# EAGLE design diode_winductor (EAGLE 6.5.0)
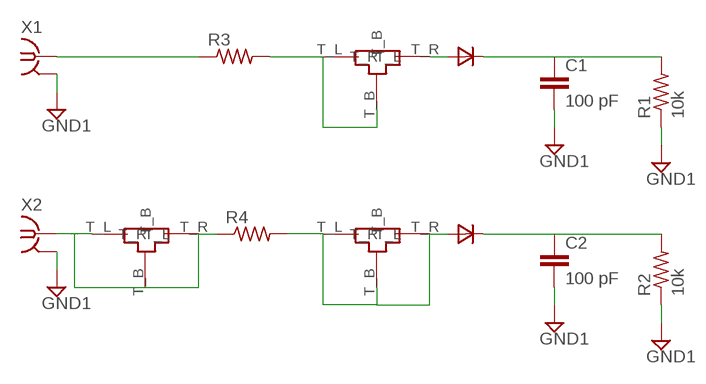
[diagram p0: schematic, sheet 1]

## Parts
C1  100 pF  C-EUC0603  [C0603]
C2  100 pF  C-EUC0603  [C0603]
INPUT  TEE_TL1  [TEE_TL1]
INPUT1  TEE_TL1  [TEE_TL1]
INPUT2  TEE_TL1  [TEE_TL1]
R1  10k  R-US_M1206  [M1206]
R2  10k  R-US_M1206  [M1206]
R3  R-US_R0603  [R0603]
R4  R-US_R0603  [R0603]
U$1  HSMS-2850  [HSMS-2850]
U$2  HSMS-2850  [HSMS-2850]
X1  SMA-142-0701-801/806  [J502-ND-142-0701-801/806]
X2  SMA-142-0701-801/806  [J502-ND-142-0701-801/806]

## Nets
GND1: C1.2 C2.2 R1.1 R2.1 X1.G@1 X1.G@2 X1.G@3 X1.G@4 X2.G@1 X2.G@2 X2.G@3 X2.G@4
INPUT: INPUT.T_B INPUT.T_L INPUT.T_R R3.2 U$1.A
INPUT1: INPUT2.T_B INPUT2.T_L INPUT2.T_R R4.1 X2.1
INPUT2: INPUT1.T_B INPUT1.T_L INPUT1.T_R R4.2 U$2.A
INPUT11: R3.1 X1.1
N$3: C1.1 R1.2 U$1.C
N$4: C2.1 R2.2 U$2.C

## Library data of the parts
C1 C2 = rcl:C-EU: CAPACITOR, European symbol
INPUT INPUT1 INPUT2 = ECE532_Parts:TEE_TL1
R1-R4 = rcl:R-US_: RESISTOR, American symbol
U$1 U$2 = ECE532_Parts:HSMS-2850
X1 X2 = con-coax:SMA-: SMA 50 Ohm End Launch Jack Receptacle - Round Contact Johnson Components Source: www.johnsoncomponents.com .. J502-ND.pdf; MF: JOHNSON COMPONENTS; MPN: 142-0701-801; OC_FARNELL: 1608592; OC_NEWARK: 90F2624

## Board
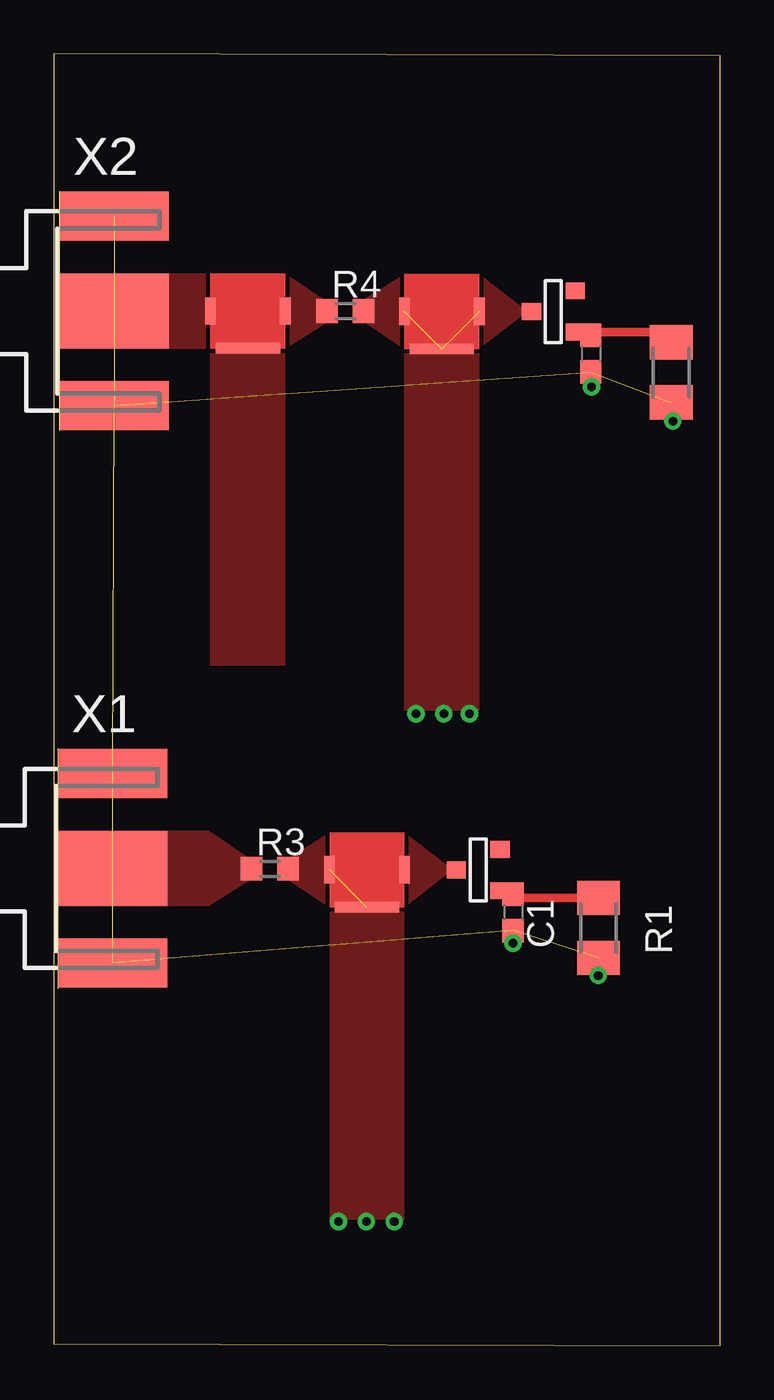
[diagram p1: board, top side]
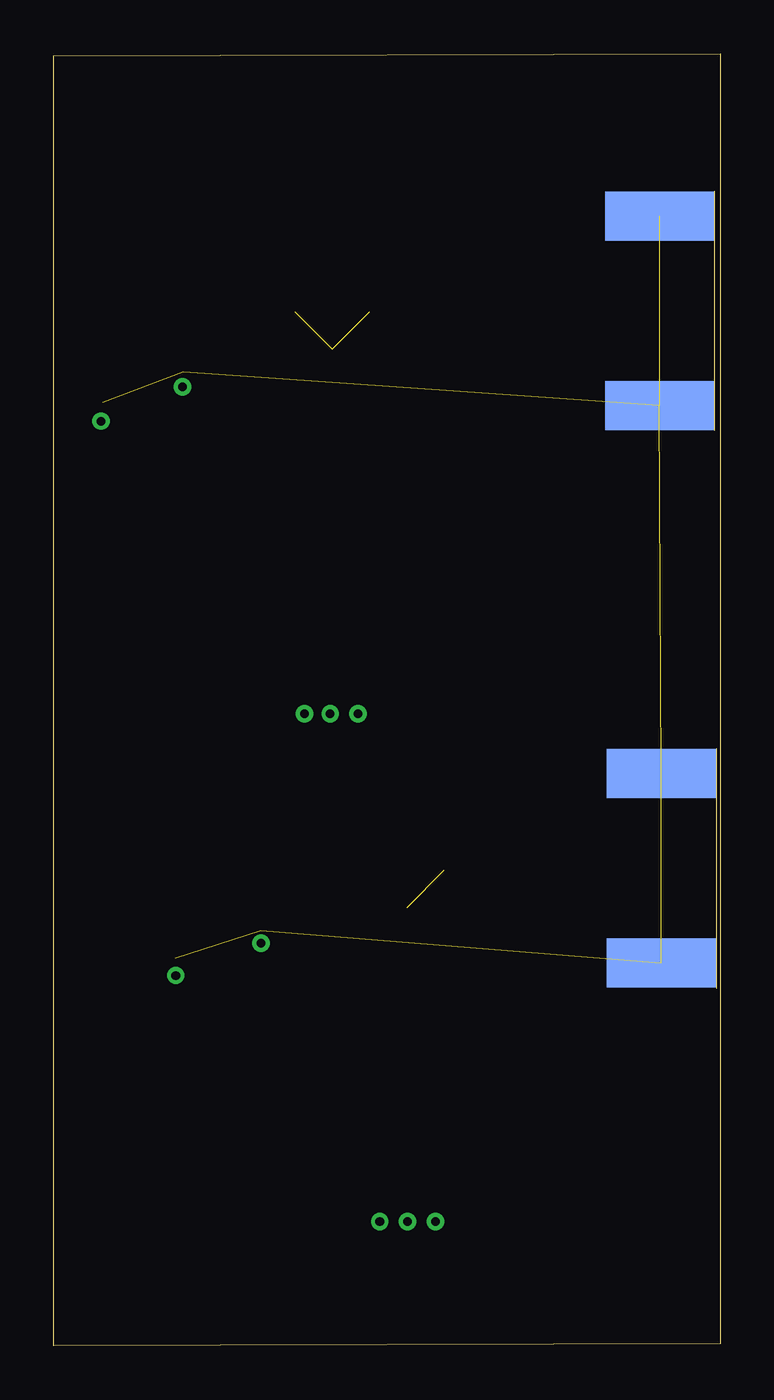
[diagram p2: board, bottom side, seen from below]

Size 31.1 x 60.3 mm. Coordinates in mm from the lower left corner, seen from the top.
Outline: 0,0.1 31.1,0 31.1,60.2 0,60.3 0,0.1
Copper layers (1*16): Top 0.035mm / dielectric 1.5mm / Bottom 0.035mm
Design rules "default": minimum track width 10mil, minimum drill 24mil, track to track 8mil, track to pad 8mil, pad to pad 8mil, via to via 8mil, smd to smd 8mil, copper to edge 40mil, drill to drill 8mil, minimum pad ring 10mil, minimum via ring 8mil, stop-mask expansion 4mil, vias tented up to drill 0mil, thermal gap 10mil

### Footprints (pad centres in the part's own frame; a part is rotated, then mirrored left to right if it is on the bottom)
C0603 = smd 1.1 x 1: 1 -0.85,0; 2 0.85,0
TEE_TL1 = smd 3 x 0.5: T_B 0,-0.475 | smd 0.5 x 1.27: T_L -1.745,1.27; T_R 1.745,1.27
M1206 = smd 1.6 x 2: 1 -1.4,0; 2 1.4,0
R0603 = smd 1 x 1.1: 1 -0.85,0; 2 0.85,0
HSMS-2850 = smd 0.787 x 0.889: A 0.025,-1.016; C 0.991,1.016; NC -0.94,1.016
J502-ND-142-0701-801/806 = smd 5.08 x 3.49: 1 2.565,0 | smd 5.08 x 2.286: G@1 2.565,4.42; G@2 2.565,-4.42 | smd 5.08 x 2.286 bottom: G@3 2.565,4.42; G@4 2.565,-4.42

### Placement (x,y rotation side)
C1  21.43,20.23 270 top
C2  25.06,46.3 270 top
INPUT  14.62,20.95 0 top
INPUT1  18.11,47 0 top
INPUT2  9.06,47.02 0 top
R1  25.42,19.5 90 top
R2  28.81,45.42 90 top
R3  10.09,22.26 0 top
R4  13.6,48.28 0 top
U$1  19.81,22.23 270 top
U$2  23.31,48.29 270 top
X1  0.2,22.28 0 top
X2  0.27,48.29 0 top

### Tracks (layer width: path | path; a pad name or v marks a point on that pad's centre or on a via)
GND1  (11 unrouted)
INPUT  (via drill 0.4)  (1 unrouted)
  other vias: 13.29,5.81 14.59,5.81 15.89,5.81
  pour Top (no thermals): 16.36,20.47 16.36,23.96 18.36,22.42 18.36,22.02
  pour Top (no thermals): 12.87,5.9 12.87,21.1 16.36,21.1 16.36,5.9
  pour Top (no thermals): 12.87,23.95 12.87,20.46 10.87,21.8 10.87,22.7
INPUT1
  pour Top (no thermals): 7.31,46.54 10.8,46.54 10.8,31.74 7.31,31.74
  pour Top (no thermals): 5.33,50.03 7.33,50.03 7.33,46.54 5.33,46.54
  pour Top (no thermals): 10.8,46.54 10.8,50.03 12.8,48.69 12.8,47.79
INPUT2  (via drill 0.4)  (2 unrouted)
  other vias: 16.9,29.5 18.2,29.5 19.4,29.5
  pour Top (no thermals): 16.37,29.65 16.37,46.52 19.86,46.52 19.86,29.65
  pour Top (no thermals): 19.85,46.52 19.85,50.01 21.85,48.47 21.85,48.07
  pour Top (no thermals): 16.36,50 16.36,46.51 14.36,47.86 14.36,48.76
INPUT11
  pour Top (no thermals): 7.23,20.54 7.23,24.03 9.23,22.68 9.23,21.78
  pour Top (no thermals): 5.25,24.02 7.25,24.02 7.25,20.53 5.25,20.53
N$1  (via drill 0.4)
  other vias: 21.42,18.79
N$2  (via drill 0.4)
  other vias: 25.4,17.28
N$3
  Top 0.4: U$1.C 21.43,21.24 C1.1 21.43,20.9 R1.2
N$4
  Top 0.4: U$2.C 25.05,47.3 | 25.05,47.3 C2.1 | 25.05,47.3 28.81,47.3 R2.2
N$6  (via drill 0.4)
  other vias: 25.08,44.75
N$7  (via drill 0.4)
  other vias: 28.88,43.15